# EAGLE schematic driver (EAGLE 9.6.2)
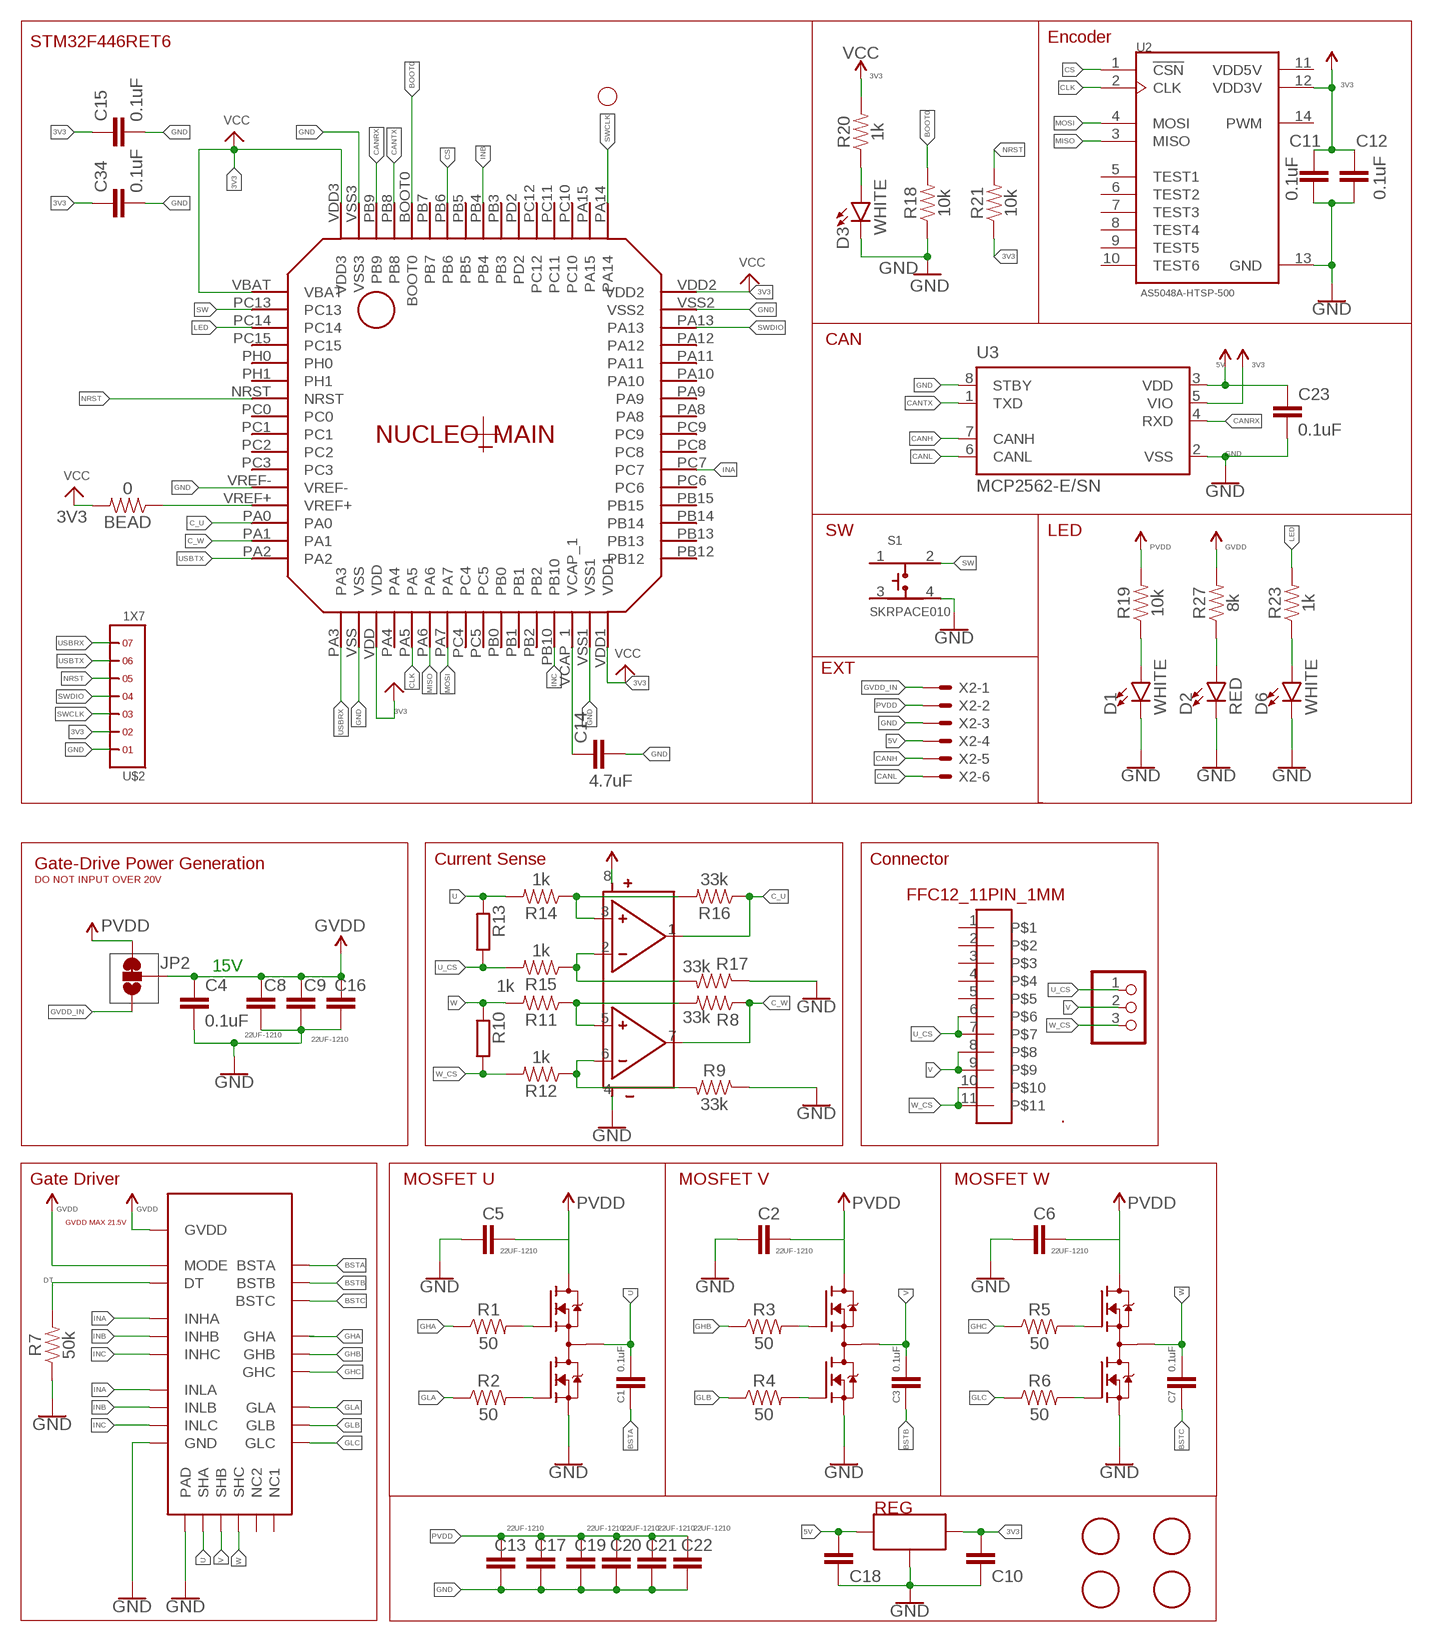
[diagram p0: schematic, sheet 1]

## Parts
.  FFC12_11PIN_1MM  [CON-SMT-FFCFPC_52207-1185]
BEAD  0  0OHM-0603-1/10W-5%  [0603]
C1  0.1uF  0.1UF-0603-25V-5%  [0603]
C2  22UF-1210  22UF-1210-16V-20%  [1210]
C3  0.1uF  0.1UF-0603-25V-5%  [0603]
C4  0.1uF  0.1UF-0603-100V-10%  [0603]
C5  22UF-1210  22UF-1210-16V-20%  [1210]
C6  22UF-1210  22UF-1210-16V-20%  [1210]
C7  0.1uF  0.1UF-0603-25V-5%  [0603]
C8  22UF-1210  22UF-1210-16V-20%  [1210]
C9  22UF-1210  22UF-1210-16V-20%  [1210]
C10  0.1UF  0.1UF_1608  [1608]
C11  0.1uF  0.1UF-0603-100V-10%  [0603]
C12  0.1uF  0.1UF-0603-100V-10%  [0603]
C13  22UF-1210  22UF-1210-16V-20%  [1210]
C14  4.7uF  0.1UF-0603-25V-(+80/-20%)  [0603]
C15  0.1uF  0.1UF-0603-25V-(+80/-20%)  [0603]
C16  22UF-1210  22UF-1210-16V-20%  [1210]
C17  22UF-1210  22UF-1210-16V-20%  [1210]
C18  0.1UF  0.1UF_1608  [1608]
C19  22UF-1210  22UF-1210-16V-20%  [1210]
C20  22UF-1210  22UF-1210-16V-20%  [1210]
C21  22UF-1210  22UF-1210-16V-20%  [1210]
C22  22UF-1210  22UF-1210-16V-20%  [1210]
C23  0.1uF  0.1UF-0603-100V-10%  [0603]
C34  0.1uF  0.1UF-0603-25V-(+80/-20%)  [0603]
D1  WHITE  LED-WHITE0603  [LED-0603]
D2  RED  LED-RED0603  [LED-0603]
D3  WHITE  LED-WHITE0603  [LED-0603]
D6  WHITE  LED-WHITE0603  [LED-0603]
JP2  JUMPER-SMT_3_1-NC_TRACE_SILK  [SMT-JUMPER_3_1-NC_TRACE_SILK]
JP3  PINHD-1X3CB  [1X03-CLEANBIG]
NUCLEO_MAIN  F446RET6  STM32F446RET6  [STM32F446RET6]
Q2  SIZ240DT-T1-GE3  [TRANS_SIZ240DT-T1-GE3]
Q3  SIZ240DT-T1-GE3  [TRANS_SIZ240DT-T1-GE3]
Q4  SIZ240DT-T1-GE3  [TRANS_SIZ240DT-T1-GE3]
R1  50  1KOHM-0603-1/10W-1%  [0603]
R2  50  1KOHM-0603-1/10W-1%  [0603]
R3  50  1KOHM-0603-1/10W-1%  [0603]
R4  50  1KOHM-0603-1/10W-1%  [0603]
R5  50  1KOHM-0603-1/10W-1%  [0603]
R6  50  1KOHM-0603-1/10W-1%  [0603]
R7  50k  1KOHM-0603-1/10W-1%  [0603]
R8  33k  1KOHM-0603-1/10W-1%  [0603]
R9  33k  1KOHM-0603-1/10W-1%  [0603]
R10  SMS-REF  [SMS-REF]
R11  1k  1KOHM-0603-1/10W-1%  [0603]
R12  1k  1KOHM-0603-1/10W-1%  [0603]
R13  SMS-REF  [SMS-REF]
R14  1k  1KOHM-0603-1/10W-1%  [0603]
R15  1k  1KOHM-0603-1/10W-1%  [0603]
R16  33k  1KOHM-0603-1/10W-1%  [0603]
R17  33k  1KOHM-0603-1/10W-1%  [0603]
R18  10k  RESISTOR-0603-1/10W-1%  [R0603]
R19  10k  2.0KOHM-0603-1/10W-5%  [0603]
R20  1k  RESISTOR-0603-1/10W-1%  [R0603]
R21  10k  RESISTOR-0603-1/10W-1%  [R0603]
R23  1k  2.0KOHM-0603-1/10W-5%  [0603]
R27  8k  2.0KOHM-0603-1/10W-5%  [0603]
REG  AP7333  [SOT95P237X112-3N]
S1  SKRPACE010  [SW_SKRPACE010]
U1  QFN50P400X400X100-25NDRV8300DRGER  [QFN50P400X400X100-25N]
U2  AS5048A-HTSP-500  [SOP65P640X120-14N]
U3  MCP2562-E/SN  [SOIC127P600X175-8N]
U4  SOP80P620X125-8N  [SOP80P620X125-8N]
U$1  PIN  [3MM]
U$2  1X7  [1X7]
U$3  PIN  [3MM]
U$4  PIN  [3MM]
U$5  PIN  [3MM]
X2  JST-XH-06-PIN-LONG-PAD  [JST-XH-06-PACKAGE-LONG-PAD]

## Nets
3V3: BEAD.2 C10.1 C11.1 C12.1 C15.1 C34.1 NUCLEO_MAIN.VBAT NUCLEO_MAIN.VDD NUCLEO_MAIN.VDD1 NUCLEO_MAIN.VDD2 NUCLEO_MAIN.VDD3 R20.2 R21.1 REG.2(OUT) U2.12(VDD3V) U3.5(VIO) U4.8(VDD) U$2.2 ; supply symbol labelled GVDD, PVDD, VCC
5V: C18.1 C23.1 REG.1(IN) U3.3(VDD) X2.4 ; supply symbol labelled GVDD
BOOT0: NUCLEO_MAIN.BOOT0 R18.2
BSTA: C1.1 U1.BSTA
BSTB: C3.1 U1.BSTB
BSTC: C7.1 U1.BSTC
C_U: NUCLEO_MAIN.PA0 R16.1 U4.1(O1)
C_W: NUCLEO_MAIN.PA1 R8.1 U4.7(O2)
CANH: U3.7(CANH) X2.5
CANL: U3.6(CANL) X2.6
CANRX: NUCLEO_MAIN.PB9 U3.4(RXD)
CANTX: NUCLEO_MAIN.PB8 U3.1(TXD)
CLK: NUCLEO_MAIN.PA5 U2.2(CLK)
CS: NUCLEO_MAIN.PB6 U2.1(!CSN)
DT: R7.2 U1.DT
GHA: R1.1 U1.GHA
GHB: R3.1 U1.GHB
GHC: R5.1 U1.GHC
GLA: R2.1 U1.GLA
GLB: R4.1 U1.GLB
GLC: R6.1 U1.GLC
GND: C2.1 C4.2 C5.1 C6.1 C8.1 C9.1 C10.2 C11.2 C12.2 C13.1 C14.2 C15.2 C16.1 C17.1 C18.2 C19.1 C20.1 C21.1 C22.1 C23.2 C34.2 D1.C D2.C D3.C D6.C NUCLEO_MAIN.VREF- NUCLEO_MAIN.VSS NUCLEO_MAIN.VSS1 NUCLEO_MAIN.VSS2 NUCLEO_MAIN.VSS3 Q2.5(S2) Q2.6(S2) Q2.7(S2) Q3.5(S2) Q3.6(S2) Q3.7(S2) Q4.5(S2) Q4.6(S2) Q4.7(S2) R7.1 R9.1 R17.1 R18.1 REG.3(GND) S1.4 U1.GND U1.PAD U2.13(GND) U3.2(VSS) U3.8(STBY) U4.4(GND) U$2.1 X2.3
GVDD: C4.1 C8.2 C9.2 C16.2 JP2.2 R27.2 U1.GVDD U1.MODE ; supply symbol labelled PVDD
GVDD_IN: JP2.1 X2.1
HA: Q2.1(G1) R1.2
HB: Q3.1(G1) R3.2
HC: Q4.1(G1) R5.2
INA: NUCLEO_MAIN.PC7 U1.INHA U1.INLA
INB: NUCLEO_MAIN.PB4 U1.INHB U1.INLB
INC: NUCLEO_MAIN.PB10 U1.INHC U1.INLC
L: D3.A R20.1
LA: Q2.8(G2) R2.2
LB: Q3.8(G2) R4.2
LC: Q4.8(G2) R6.2
LED: NUCLEO_MAIN.PC14 R23.2
MISO: NUCLEO_MAIN.PA6 U2.3(MISO)
MOSI: NUCLEO_MAIN.PA7 U2.4(MOSI)
N$8: R8.2 R11.1 U4.5(P2)
N$9: R9.2 R12.1 U4.6(M2)
N$10: R14.1 R16.2 U4.3(P1)
N$11: R15.1 R17.2 U4.2(M1)
N$14: D1.A R19.1
N$15: D2.A R27.1
N$21: D6.A R23.1
NRST: NUCLEO_MAIN.NRST R21.2 U$2.5
PVDD: C2.2 C5.2 C6.2 C13.2 C17.2 C19.2 C20.2 C21.2 C22.2 JP2.3 Q2.2(D1) Q2.3(D1) Q2.4(D1) Q2.10(D1) Q3.2(D1) Q3.3(D1) Q3.4(D1) Q3.10(D1) Q4.2(D1) Q4.3(D1) Q4.4(D1) Q4.10(D1) R19.2 X2.2 ; supply symbol labelled GVDD
SW: NUCLEO_MAIN.PC13 S1.2
SWCLK: NUCLEO_MAIN.PA14 U$2.3
SWDIO: NUCLEO_MAIN.PA13 U$2.4
U: C1.2 Q2.9(S1/D2) R13.2 R14.2 U1.SHA
U_CS: ..6 ..7 JP3.1 R13.1 R15.2
USBRX: NUCLEO_MAIN.PA3 U$2.7
USBTX: NUCLEO_MAIN.PA2 U$2.6
V: ..8 ..9 C3.2 JP3.2 Q3.9(S1/D2) U1.SHB
VCAP: C14.1 NUCLEO_MAIN.VCAP_1
VDDA: BEAD.1 NUCLEO_MAIN.VREF+
W: C7.2 Q4.9(S1/D2) R10.2 R11.2 U1.SHC
W_CS: ..10 ..11 JP3.3 R10.1 R12.2
Unconnected: ..1 ..2 ..3 ..4 ..5 NUCLEO_MAIN.PA4 NUCLEO_MAIN.PA8 NUCLEO_MAIN.PA9 NUCLEO_MAIN.PA10 NUCLEO_MAIN.PA11 NUCLEO_MAIN.PA12 NUCLEO_MAIN.PA15 NUCLEO_MAIN.PB0 NUCLEO_MAIN.PB1 NUCLEO_MAIN.PB2 NUCLEO_MAIN.PB3 NUCLEO_MAIN.PB5 NUCLEO_MAIN.PB7 NUCLEO_MAIN.PB12 NUCLEO_MAIN.PB13 NUCLEO_MAIN.PB14 NUCLEO_MAIN.PB15 NUCLEO_MAIN.PC0 NUCLEO_MAIN.PC1 NUCLEO_MAIN.PC2 NUCLEO_MAIN.PC3 NUCLEO_MAIN.PC4 NUCLEO_MAIN.PC5 NUCLEO_MAIN.PC6 NUCLEO_MAIN.PC8 NUCLEO_MAIN.PC9 NUCLEO_MAIN.PC10 NUCLEO_MAIN.PC11 NUCLEO_MAIN.PC12 NUCLEO_MAIN.PC15 NUCLEO_MAIN.PD2 NUCLEO_MAIN.PH0 NUCLEO_MAIN.PH1 S1.1 S1.3 U1.NC1 U1.NC2 U2.5(TEST1) U2.6(TEST2) U2.7(TEST3) U2.8(TEST4) U2.9(TEST5) U2.10(TEST6) U2.14(PWM) U$1.P$1 U$3.P$1 U$4.P$1 U$5.P$1

## Notes on the sheet
- STM32F446RET6 | Encoder
- CAN
- SW | LED
- Recommended
- EXT
- Gate-Drive Power Generation | Current Sense | Connector
- DO NOT INPUT OVER 20V
- 15V
- Gate Driver | MOSFET U | MOSFET V | MOSFET W
- GVDD MAX 21.5V

## Power pins joined to a net without a drawn wire
VDD5V: U2.11(VDD5V)

## Library data of the parts
. = MotorDriver_FourthEdition_prot:FFC12_11PIN_1MM
BEAD = SparkFun-Resistors:0OHM: 0Ω resistor A resistor is a passive two-terminal electrical component that implements electrical resistance as a circuit element. Resistors act to reduce current flow, and, at the same time, act to lower voltage levels within circuits. - Wikipedia; PROD_ID: RES-08609
C1 C3 C7 = SparkFun-Capacitors:0.1UF: 0.1µF ceramic capacitors A capacitor is a passive two-terminal electrical component used to store electrical energy temporarily in an electric field.; PROD_ID: CAP-08604
C2 C5 C6 C8 C9 C13 C16 C17 C19-C22 = SparkFun-Capacitors:22UF: 22µF ceramic capacitors A capacitor is a passive two-terminal electrical component used to store electrical energy temporarily in an electric field.
C4 C11 C12 C23 = SparkFun-Capacitors:0.1UF: 0.1µF ceramic capacitors A capacitor is a passive two-terminal electrical component used to store electrical energy temporarily in an electric field.; PROD_ID: CAP-08390
C10 C18 = Custom_Designed_By_Yusei:0.1UF_1608
C14 = SparkFun-Capacitors:0.1UF: 0.1µF ceramic capacitors A capacitor is a passive two-terminal electrical component used to store electrical energy temporarily in an electric field.; PROD_ID: CAP-00810; VALUE: 0.1uF
C15 C34 = SparkFun-Capacitors:0.1UF: 0.1µF ceramic capacitors A capacitor is a passive two-terminal electrical component used to store electrical energy temporarily in an electric field.; PROD_ID: CAP-00810
D1 D3 D6 = SparkFun-LED:LED-WHITE: White SMD LED Used in manufacturing several products at SparkFun. Packages: 0603 - Bright White SMD 0603 package[Product Link] <http://www.kingbrightusa.com/product.asp?catalog_name=LED&product_id=APT1608QWF/D> 1206 - Bright White SMD1206 package [Product Link] <http://www.kingbrightusa.com/product.asp?catalog_name=LED&product_id=APT3216QWF/D> 3014 - Super Bright SMD 3014 package [Datasheet] <http://www.lumileds.com/uploads/459/DS208-pdf> SparkFun Products: Blackberry Trackballer Breakout <https://www.sparkfun.com/products/13169> Digital SandBox <https://www.sparkfun.com/products/12651>; PROD_ID: DIO-09004
D2 = SparkFun-LED:LED-RED: Red SMD LED Used in manufacturing of most products at SparkFun Packages: 0603 - SMD 0603 package [Product Link] <http://docs.avagotech.com/docs/AV02-0551EN> 0603 SMART - SMD 0603 SMART package ( more efficient and expensive)[Product Link] <http://www.osram-os.com/Graphics/XPic2/00077099_0.pdf> 1206 - SMD1206 package [Product Link] <https://www.sparkfun.com/datasheets/DevTools/LilyPad/Q150OVS4.pdff> SparkFun Products: Pro Mini 328 -5V <https://www.sparkfun.com/products/821> RedBoard <https://www.sparkfun.com/products/12757> IOIO-OTG <https://www.sparkfun.com/products/13613>; PROD_ID: DIO-00819
JP2 = SparkFun-Jumpers:JUMPER-SMT_3_1-NC_TRACE: Normally closed trace jumper (1 of 2 connections) This jumper has a trace between two pads so it's normally closed (NC). The other connection is normally open (NO). Use a razor knife to open the connection. For best results follow the IPC guidelines for cutting traces: Cutout at least 0.063 mm (0.005 in). Remove all loose material to clean up the cut area. Seal the cut with an approved epoxy. Reapply solder to reclose the connection, or to close the NO connection.
JP3 = adafruit:PINHD-1X3: PIN HEADER
NUCLEO_MAIN = STM32F446RET6:STM32F446RET6
Q2-Q4 = SIZ240DT-T1-GE3:SIZ240DT-T1-GE3: Check availability <https://pricing.snapeda.com/parts/SIZ240DT-T1-GE3/Vishay%20Siliconix/view-part?ref=eda>; AVAILABILITY: In Stock; DESCRIPTION: Mosfet Array 2 N-Channel (Dual) 40V 17.2A (Ta), 48A (Tc), 16.9A (Ta), 47A (Tc) 4.3W (Ta), 33W (Tc) Surface Mount 8-PowerPair® (3.3x3.3); MF: Vishay Siliconix; MP: SIZ240DT-T1-GE3; PACKAGE: PowerWDFN-8 Vishay Siliconix; PRICE: None; PURCHASE-URL: https://pricing.snapeda.com/search/part/SIZ240DT-T1-GE3/?ref=eda
R1-R9 R16 R17 = SparkFun-Resistors:1KOHM: 1kΩ resistor A resistor is a passive two-terminal electrical component that implements electrical resistance as a circuit element. Resistors act to reduce current flow, and, at the same time, act to lower voltage levels within circuits. - Wikipedia; PROD_ID: RES-07856; VALUE: 1k
R10 R13 = resistor-shunt:SMS-REF: SMD SHUNT RESISTOR; OC_FARNELL: unknown; OC_NEWARK: unknown
R11 R12 R14 R15 = SparkFun-Resistors:1KOHM: 1kΩ resistor A resistor is a passive two-terminal electrical component that implements electrical resistance as a circuit element. Resistors act to reduce current flow, and, at the same time, act to lower voltage levels within circuits. - Wikipedia; PROD_ID: RES-07856
R18 R21 = Custom_Designed_By_Yusei:RESISTOR: Resistor; PROD_ID: RES-07856; VALUE: 1k
R19 R23 R27 = SparkFun-Resistors:2.0KOHM: 2kΩ resistor A resistor is a passive two-terminal electrical component that implements electrical resistance as a circuit element. Resistors act to reduce current flow, and, at the same time, act to lower voltage levels within circuits. - Wikipedia; PROD_ID: RES-08296; VALUE: 2.0k
R20 = Custom_Designed_By_Yusei:RESISTOR: Resistor; PROD_ID: RES-07856
REG = SOT95P237X112-3N:AP7333
S1 = Alps SW:SKRPACE010: Switch Tactile N.O. SPST Button J-Bend 0.05A 16VDC 2.55N SMD Automotive T/R; AVAILABILITY: Good; DESCRIPTION: Switch Tactile N.O. SPST Button J-Bend 0.05A 16VDC 2.55N SMD Automotive T/R; MF: ALPS; MP: SKRPACE010; PACKAGE: None; PRICE: 0.29 USD
U1 = DRV8300DRGER:QFN50P400X400X100-25N: DRV8300
U2 = AS5048A-HTSP-500:AS5048A-HTSP-500: AS5048B Series 360° 3.3 / 5 V 14 bit Magnetic Rotary Encoder - TSSOP-14 Check availability <https://pricing.snapeda.com/parts/AS5048A-HTSP-500/ams/view-part?ref=eda>; AVAILABILITY: In Stock; DESCRIPTION: Hall Effect Sensor Angle External Magnet, Not Included Gull Wing; MF: ams; MP: AS5048A-HTSP-500; PACKAGE: TSSOP-14 ams; PRICE: None; PURCHASE-URL: https://pricing.snapeda.com/search/part/AS5048A-HTSP-500/?ref=eda
U3 = MCP2562-E_SN:MCP2562-E/SN: MCP2562 Series 5 V Surface Mount High-Speed CAN Transceiver - SOIC-8 Check availability <https://pricing.snapeda.com/parts/MCP2562-E/SN/Microchip/view-part?ref=eda>; AVAILABILITY: In Stock; DESCRIPTION: 1/1 Transceiver Half CANbus 8-SOIC; MF: Microchip; MP: MCP2562-E/SN; PACKAGE: SO-8 Microchip; PRICE: None; PURCHASE-URL: https://pricing.snapeda.com/search/part/MCP2562-E/SN/?ref=eda
U4 = NJM2732:SOP80P620X125-8N; A1_MIN: 0.0; A_MAX: 1.25; A_MIN: 1.25; A_NOM: 1.25; B_MAX: 0.35; B_MIN: 0.35; B_NOM: 0.35; D2_MAX: 0.0; D_MAX: 3.5; D_MIN: 3.5; D_NOM: 3.5; E1_MAX: 4.2; E1_MIN: 4.2; E1_NOM: 4.2; E2_MAX: 0.0; ENOM: 0.8; E_MAX: 6.2; E_MIN: 6.2; E_NOM: 6.2; L_MAX: 0.5; L_MIN: 0.5; L_NOM: 0.5; MANUFACTURER: New Japan Radio; PIN_COUNT: 8.0; SNAPEDA_PACKAGE_ID: 11524; STANDARD: IPC 7351B
U$1 U$3-U$5 = pin:PIN
U$2 = headers(2mm):1X7
X2 = Rembrandt Electronics - JST XH Connectors v1-0:JST-XH-06-PIN: JST XH Connector 2 Pin Wire to board connector. Pitch: 2,54 mm, (0.100") Number of pins: 6 Created by Rembrandt Electronics www.rembrandtelectronics.com

## Net classes
0 default: width 0.3 mm